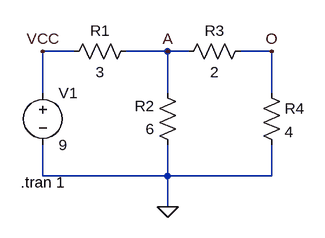
[diagram p0: schematic circuit2.asc]
circuit2.asc, the LTspice schematic file:
Version 4
SHEET 1 880 680
WIRE 112 64 64 64
WIRE 256 64 192 64
WIRE 288 64 256 64
WIRE 416 64 368 64
WIRE 64 128 64 64
WIRE 256 128 256 64
WIRE 416 128 416 64
WIRE 64 256 64 208
WIRE 256 256 256 208
WIRE 256 256 64 256
WIRE 416 256 416 208
WIRE 416 256 256 256
WIRE 256 304 256 256
FLAG 416 64 O
FLAG 256 64 A
FLAG 256 304 0
FLAG 64 64 VCC
SYMBOL voltage 64 112 R0
WINDOW 123 0 0 Left 0
WINDOW 39 0 0 Left 0
SYMATTR InstName V1
SYMATTR Value 9
SYMBOL res 208 48 R90
WINDOW 0 0 56 VBottom 2
WINDOW 3 32 56 VTop 2
SYMATTR InstName R1
SYMATTR Value 3
SYMBOL res 272 224 R180
WINDOW 0 36 76 Left 2
WINDOW 3 36 40 Left 2
SYMATTR InstName R2
SYMATTR Value 6
SYMBOL res 384 48 R90
WINDOW 0 0 56 VBottom 2
WINDOW 3 32 56 VTop 2
SYMATTR InstName R3
SYMATTR Value 2
SYMBOL res 400 112 R0
SYMATTR InstName R4
SYMATTR Value 4
TEXT 30 266 Left 2 !.tran 1

The netlist it stands for:
* circuit2.asc
V1 VCC 0 9
R1 A VCC 3
R2 0 A 6
R3 O A 2
R4 O 0 4
.tran 1
.backanno
.end